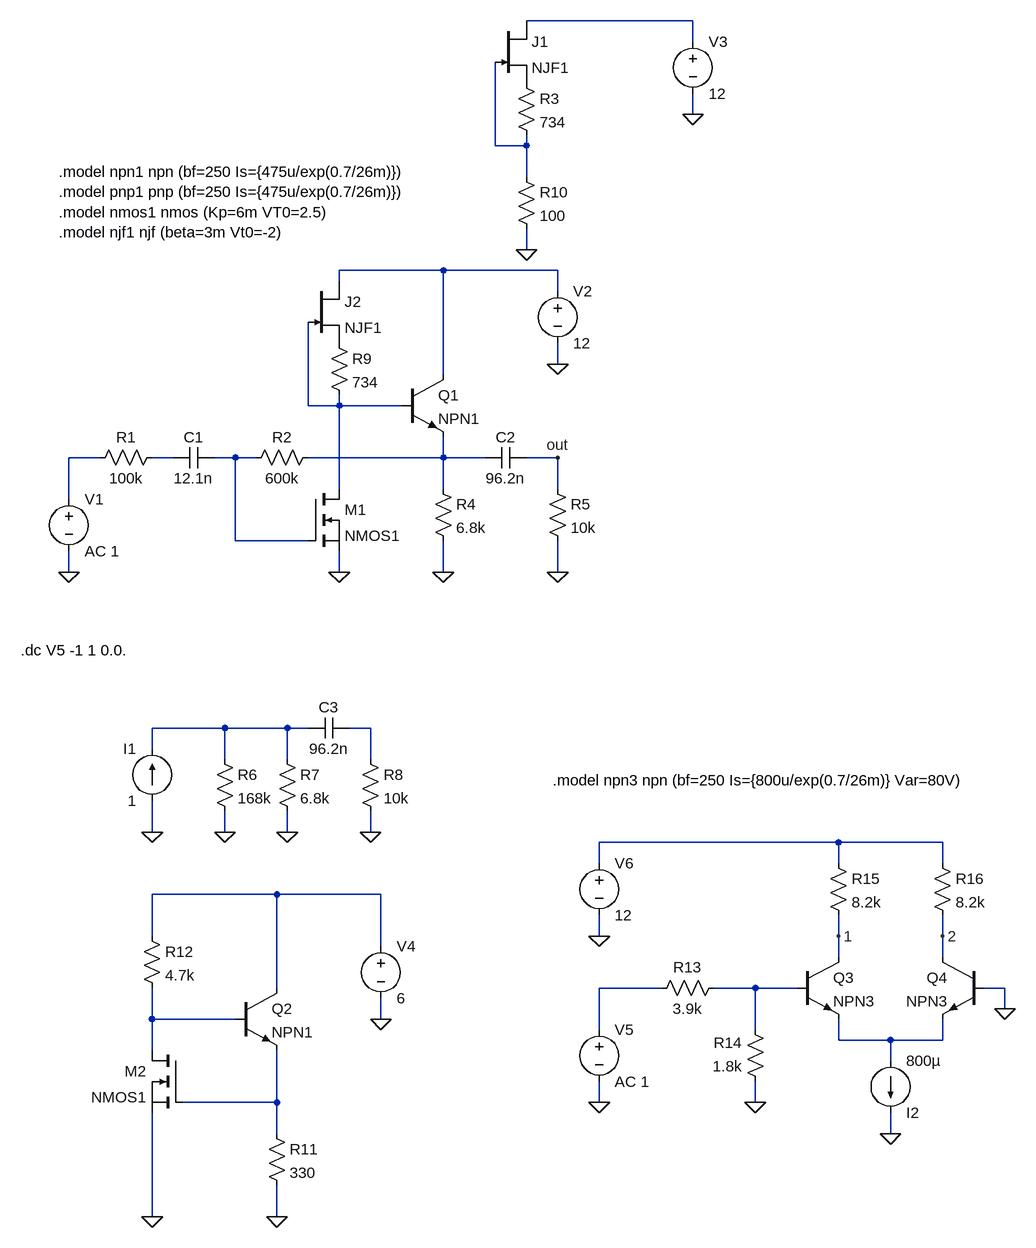
[diagram p0: schematic ws06_07.asc]
ws06_07.asc, the LTspice schematic file:
Version 4
SHEET 1 2084 1876
WIRE 1552 16 1296 16
WIRE 1552 48 1552 16
WIRE 1552 160 1552 128
WIRE 1248 208 1248 80
WIRE 1296 208 1296 192
WIRE 1296 208 1248 208
WIRE 1296 256 1296 208
WIRE 1296 368 1296 336
WIRE 1168 400 1008 400
WIRE 1344 400 1168 400
WIRE 1008 416 1008 400
WIRE 1344 432 1344 400
WIRE 1344 544 1344 512
WIRE 1168 560 1168 400
WIRE 960 608 960 480
WIRE 1008 608 1008 592
WIRE 1008 608 960 608
WIRE 1104 608 1008 608
WIRE 640 688 592 688
WIRE 752 688 720 688
WIRE 848 688 816 688
WIRE 880 688 848 688
WIRE 1168 688 1168 656
WIRE 1168 688 960 688
WIRE 1232 688 1168 688
WIRE 1344 688 1296 688
WIRE 1008 736 1008 608
WIRE 1168 736 1168 688
WIRE 1344 736 1344 688
WIRE 592 752 592 688
WIRE 848 816 848 688
WIRE 960 816 848 816
WIRE 592 864 592 832
WIRE 1008 864 1008 832
WIRE 1168 864 1168 816
WIRE 1344 864 1344 816
WIRE 832 1104 720 1104
WIRE 928 1104 832 1104
WIRE 960 1104 928 1104
WIRE 1056 1104 1024 1104
WIRE 720 1136 720 1104
WIRE 832 1152 832 1104
WIRE 928 1152 928 1104
WIRE 1056 1152 1056 1104
WIRE 720 1264 720 1216
WIRE 832 1264 832 1232
WIRE 928 1264 928 1232
WIRE 1056 1264 1056 1232
WIRE 1776 1280 1408 1280
WIRE 1936 1280 1776 1280
WIRE 1408 1312 1408 1280
WIRE 1776 1312 1776 1280
WIRE 1936 1312 1936 1280
WIRE 912 1360 720 1360
WIRE 1072 1360 912 1360
WIRE 720 1424 720 1360
WIRE 1408 1424 1408 1392
WIRE 1776 1424 1776 1392
WIRE 1936 1424 1936 1392
WIRE 1072 1440 1072 1360
WIRE 1776 1456 1776 1424
WIRE 1936 1456 1936 1424
WIRE 912 1504 912 1360
WIRE 1504 1504 1408 1504
WIRE 1648 1504 1584 1504
WIRE 1712 1504 1648 1504
WIRE 2032 1504 2000 1504
WIRE 2032 1536 2032 1504
WIRE 720 1552 720 1504
WIRE 848 1552 720 1552
WIRE 1072 1552 1072 1520
WIRE 1408 1568 1408 1504
WIRE 1648 1568 1648 1504
WIRE 1776 1584 1776 1552
WIRE 1856 1584 1776 1584
WIRE 1936 1584 1936 1552
WIRE 1936 1584 1856 1584
WIRE 720 1600 720 1552
WIRE 1856 1616 1856 1584
WIRE 912 1680 912 1600
WIRE 912 1680 768 1680
WIRE 1408 1680 1408 1648
WIRE 1648 1680 1648 1648
WIRE 912 1728 912 1680
WIRE 1856 1728 1856 1696
WIRE 720 1856 720 1696
WIRE 912 1856 912 1808
FLAG 592 864 0
FLAG 1344 864 0
FLAG 1168 864 0
FLAG 1008 864 0
FLAG 1344 544 0
FLAG 1056 1264 0
FLAG 928 1264 0
FLAG 832 1264 0
FLAG 720 1264 0
FLAG 1344 688 out
FLAG 1296 368 0
FLAG 1552 160 0
FLAG 1072 1552 0
FLAG 912 1856 0
FLAG 720 1856 0
FLAG 1408 1680 0
FLAG 1408 1424 0
FLAG 1856 1728 0
FLAG 1648 1680 0
FLAG 2032 1536 0
FLAG 1936 1424 2
FLAG 1776 1424 1
SYMBOL voltage 592 736 R0
WINDOW 123 0 0 Left 2
WINDOW 39 0 0 Left 2
SYMATTR InstName V1
SYMATTR Value AC 1
SYMBOL res 736 672 R90
WINDOW 0 0 56 VBottom 2
WINDOW 3 32 56 VTop 2
SYMATTR InstName R1
SYMATTR Value 100k
SYMBOL cap 816 672 R90
WINDOW 0 0 32 VBottom 2
WINDOW 3 32 32 VTop 2
SYMATTR InstName C1
SYMATTR Value 12.1n
SYMBOL res 976 672 R90
WINDOW 0 0 56 VBottom 2
WINDOW 3 32 56 VTop 2
SYMATTR InstName R2
SYMATTR Value 600k
SYMBOL nmos 960 736 R0
SYMATTR InstName M1
SYMATTR Value NMOS1
SYMBOL npn 1104 560 R0
SYMATTR InstName Q1
SYMATTR Value NPN1
SYMBOL res 1152 720 R0
SYMATTR InstName R4
SYMATTR Value 6.8k
SYMBOL res 1328 720 R0
SYMATTR InstName R5
SYMATTR Value 10k
SYMBOL cap 1296 672 R90
WINDOW 0 0 32 VBottom 2
WINDOW 3 32 32 VTop 2
SYMATTR InstName C2
SYMATTR Value 96.2n
SYMBOL voltage 1344 416 R0
WINDOW 123 24 124 Left 2
WINDOW 39 0 0 Left 2
SYMATTR InstName V2
SYMATTR Value 12
SYMBOL current 720 1216 R180
WINDOW 0 24 80 Left 2
WINDOW 3 24 0 Left 2
WINDOW 123 0 0 Left 2
WINDOW 39 0 0 Left 2
SYMATTR InstName I1
SYMATTR Value 1
SYMBOL res 816 1136 R0
SYMATTR InstName R6
SYMATTR Value 168k
SYMBOL res 912 1136 R0
SYMATTR InstName R7
SYMATTR Value 6.8k
SYMBOL res 1040 1136 R0
SYMATTR InstName R8
SYMATTR Value 10k
SYMBOL cap 1024 1088 R90
WINDOW 0 0 32 VBottom 2
WINDOW 3 32 32 VTop 2
SYMATTR InstName C3
SYMATTR Value 96.2n
SYMBOL res 1280 240 R0
SYMATTR InstName R10
SYMATTR Value 100
SYMBOL voltage 1552 32 R0
WINDOW 123 24 124 Left 2
WINDOW 39 0 0 Left 2
SYMATTR InstName V3
SYMATTR Value 12
SYMBOL njf 1248 16 R0
SYMATTR InstName J1
SYMATTR Value NJF1
SYMBOL res 1280 96 R0
SYMATTR InstName R3
SYMATTR Value 734
SYMBOL njf 960 416 R0
SYMATTR InstName J2
SYMATTR Value NJF1
SYMBOL res 992 496 R0
SYMATTR InstName R9
SYMATTR Value 734
SYMBOL nmos 768 1600 M0
SYMATTR InstName M2
SYMATTR Value NMOS1
SYMBOL res 896 1712 R0
SYMATTR InstName R11
SYMATTR Value 330
SYMBOL npn 848 1504 R0
SYMATTR InstName Q2
SYMATTR Value NPN1
SYMBOL res 704 1408 R0
SYMATTR InstName R12
SYMATTR Value 4.7k
SYMBOL voltage 1072 1424 R0
WINDOW 123 24 124 Left 2
WINDOW 39 0 0 Left 2
SYMATTR InstName V4
SYMATTR Value 6
SYMBOL voltage 1408 1552 R0
WINDOW 123 0 0 Left 2
WINDOW 39 0 0 Left 2
SYMATTR InstName V5
SYMATTR Value AC 1
SYMBOL res 1600 1488 R90
WINDOW 0 0 56 VBottom 2
WINDOW 3 32 56 VTop 2
SYMATTR InstName R13
SYMATTR Value 3.9k
SYMBOL res 1664 1664 R180
WINDOW 0 36 76 Left 2
WINDOW 3 36 40 Left 2
SYMATTR InstName R14
SYMATTR Value 1.8k
SYMBOL npn 1712 1456 R0
SYMATTR InstName Q3
SYMATTR Value NPN3
SYMBOL npn 2000 1456 M0
SYMATTR InstName Q4
SYMATTR Value NPN3
SYMBOL res 1760 1296 R0
SYMATTR InstName R15
SYMATTR Value 8.2k
SYMBOL res 1920 1296 R0
SYMATTR InstName R16
SYMATTR Value 8.2k
SYMBOL voltage 1408 1296 R0
WINDOW 123 24 124 Left 2
WINDOW 39 0 0 Left 2
SYMATTR InstName V6
SYMATTR Value 12
SYMBOL current 1856 1616 R0
WINDOW 0 24 80 Left 2
WINDOW 3 24 0 Left 2
WINDOW 123 0 0 Left 2
WINDOW 39 0 0 Left 2
SYMATTR InstName I2
SYMATTR Value 800µ
TEXT 518 984 Left 2 !.dc V5 -1 1 0.0.
TEXT 576 248 Left 2 !.model npn1 npn (bf=250 Is={475u/exp(0.7/26m)})\n.model pnp1 pnp (bf=250 Is={475u/exp(0.7/26m)})\n.model nmos1 nmos (Kp=6m VT0=2.5)\n.model njf1 njf (beta=3m Vt0=-2)
TEXT 1336 1184 Left 2 !.model npn3 npn (bf=250 Is={800u/exp(0.7/26m)} Var=80V)

The netlist it stands for:
* ws06_07.asc
V1 N005 0 AC 1
R1 N006 N005 100k
C1 N007 N006 12.1n
R2 N008 N007 600k
M1 N004 N007 0 0 NMOS1
Q1 N003 N004 N008 0 NPN1
R4 N008 0 6.8k
R5 out 0 10k
C2 out N008 96.2n
V2 N003 0 12
I1 0 N009 1
R6 N009 0 168k
R7 N009 0 6.8k
R8 N010 0 10k
C3 N010 N009 96.2n
R10 N002 0 100
V3 N001 0 12
J1 N001 N002 P001 NJF1
R3 P001 N002 734
J2 N003 N004 P002 NJF1
R9 P002 N004 734
M2 N015 N017 0 0 NMOS1
R11 N017 0 330
Q2 N012 N015 N017 0 NPN1
R12 N012 N015 4.7k
V4 N012 0 6
V5 N013 0 AC 1
R13 N014 N013 3.9k
R14 0 N014 1.8k
Q3 1 N014 N016 0 NPN3
Q4 2 0 N016 0 NPN3
R15 N011 1 8.2k
R16 N011 2 8.2k
V6 N011 0 12
I2 N016 0 800µ
.model NPN NPN
.model PNP PNP
.lib standard.bjt
.model NJF NJF
.model PJF PJF
.lib standard.jft
.model NMOS NMOS
.model PMOS PMOS
.lib standard.mos
.dc V5 -1 1 0.0.
.model npn1 npn (bf=250 Is={475u/exp(0.7/26m)})
.model pnp1 pnp (bf=250 Is={475u/exp(0.7/26m)})
.model nmos1 nmos (Kp=6m VT0=2.5)
.model njf1 njf (beta=3m Vt0=-2)
.model npn3 npn (bf=250 Is={800u/exp(0.7/26m)} Var=80V)
.backanno
.end